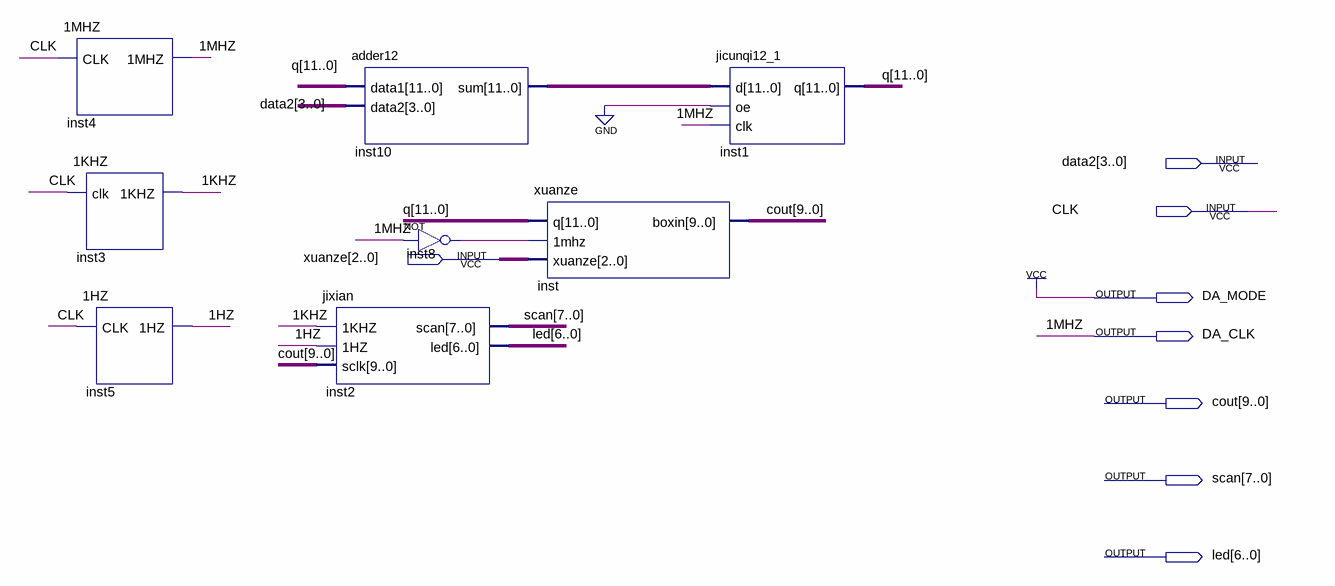
[diagram p0: schematic sheet]
// Quartus schematic TOTAL.bdf as structural Verilog: 8 symbols, 8 pins
module TOTAL (
  input  [3:0] data2,
  input  CLK,
  input  [2:0] xuanze,
  output DA_MODE,
  output DA_CLK,
  output [9:0] cout,
  output [7:0] scan,
  output [6:0] led
);

  wire \1HZ , \1KHZ , inst8_out;
  wire [11:0] inst10_sum, q;

  \1MHZ  inst4 (.CLK(CLK), .\1MHZ (DA_CLK));
  \1KHZ  inst3 (.clk(CLK), .\1KHZ (\1KHZ ));
  \1HZ  inst5 (.CLK(CLK), .\1HZ (\1HZ ));
  jixian inst2 (.\1KHZ (\1KHZ ), .\1HZ (\1HZ ), .sclk(cout), .scan(scan), .led(led));
  adder12 inst10 (.data1(q), .data2(data2), .sum(inst10_sum));
  not inst8 (inst8_out, DA_CLK);
  xuanze inst (.q(q), .\1mhz (inst8_out), .xuanze(xuanze), .boxin(cout));
  jicunqi12_1 inst1 (.d(inst10_sum), .oe(1'b0), .clk(DA_CLK), .q(q));

  assign DA_MODE = 1'b1;

  // Other names for the same wires on the sheet: 1MHZ = DA_CLK
endmodule
